# Altium schematic sheet Block Diagram.SchDoc
size 420 x 297 mm; Date: 28.05.2024; ApprovedBy: Arda B.; CheckedBy: Arda B.; DrawnBy: Arda Bozkurt; Revision: 001; SheetNumber: 2; SheetTotal: 6; Department: HDD; Size: A3; Time: 28.05.2024
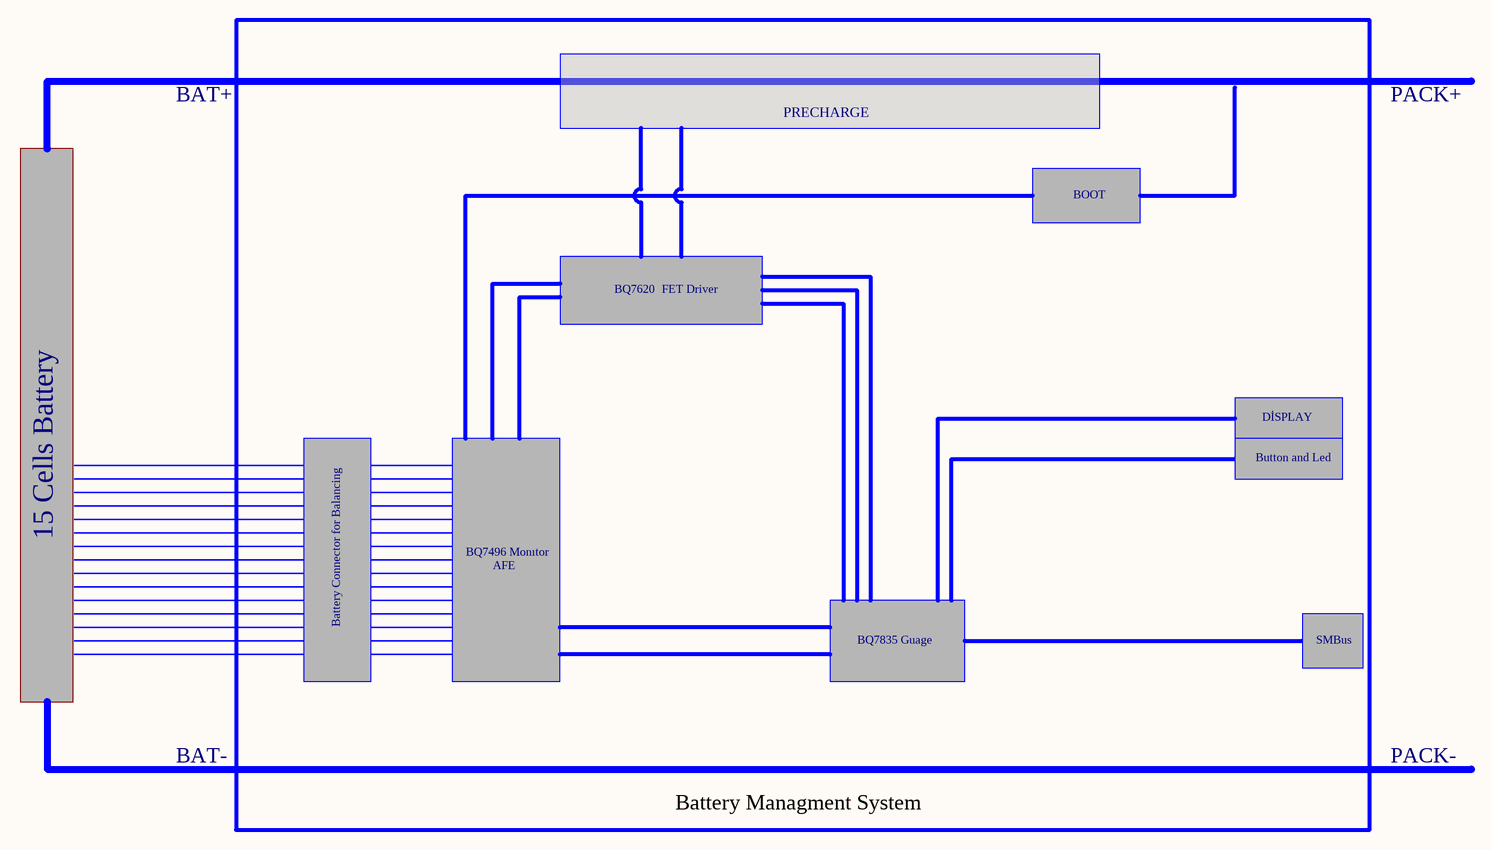
[diagram p0: Block Diagram.SchDoc]

## Notes on the sheet
- BAT+
- PACK+
- PRECHARGE
- BOOT
- BQ7620
- FET Driver
- DİSPLAY
- Button and Led
- 15 Cells Battery
- BQ7496 Monıtor
- AFE
- Battery Connector for Balancing
- BQ7835 Guage
- SMBus
- BAT-
- PACK-
- Battery Managment System
- REVİSİON
- DESCRIPTION
- DATE
- APPROVED
- DWG NO:
- TAINIM/DESCRIPTION
- REV:
- DOSYA ADI/FİLE NAME
- HAZIRLAYAN/PREPARED BY
- KONTROL EDEN/ CHECKED BY
- YAYIN TARİHİ/REL. DATE
- DEĞ TARİHİ/CHANCE DATE
- ONAYLAYAN/APPROVED BY
- REVİZYON/REVISION
- Arda Bozkurt
- BÖLÜM/DEPARTMENT
- BOYUT/SİZE
- SAYFA/SHEET
- of